# EAGLE design 25LC020A (EAGLE 9.1.3)
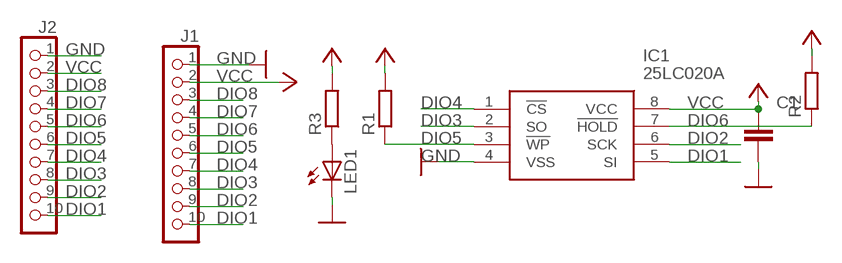
[diagram p0: schematic, sheet 1]

## Parts
C1  CAPACITOR_NPOL-0603  [C603]
IC1  25LC020A  25LC020A-I_SN  [SOIC127P600X175-8N]
J1  CON_HEADER_1X10-RIGHT_ANGLED_PTH  [M1X10_FEMALE_RIGHT_ANGLED_PTH]
J2  CON_HEADER_1X10-PTH  [M1X10]
LED1  LED-0805  [LED-805]
R1  RESISTOR-0603  [R603]
R2  RESISTOR-0603  [R603]
R3  RESISTOR-0603  [R603]

## Nets
DIO1: IC1.5(SI) J1.10 J2.10
DIO2: IC1.6(SCK) J1.9 J2.9
DIO3: IC1.2(SO) J1.8 J2.8
DIO4: IC1.1(!CS) J1.7 J2.7
DIO5: IC1.3(!WP) J1.6 J2.6 R1.1
DIO6: IC1.7(!HOLD) J1.5 J2.5 R2.1
DIO7: J1.4 J2.4
DIO8: J1.3 J2.3
GND: C1.2 IC1.4(VSS) J1.1 J2.1 LED1.C
N$1: LED1.A R3.1
VCC: C1.1 IC1.8(VCC) J1.2 J2.2 R1.2 R2.2 R3.2

## Library data of the parts
C1 = dp_devices.v6:CAPACITOR_NPOL: Non-Polarized capacitor in various packages
IC1 = SamacSys_Parts:25LC020A-I_SN: 2K,256 X 8, 2.5V Serial EE SOIC-8 Source: Datasheet <http://ww1.microchip.com/downloads/en/DeviceDoc/21833G.pdf>; DESCRIPTION: 2K,256 X 8, 2.5V Serial EE SOIC-8; HEIGHT: 1.75mm; MANUFACTURER_NAME: Microchip; MANUFACTURER_PART_NUMBER: 25LC020A-I/SN
J1 J2 = dp_devices.v6:CON_HEADER_1X10
LED1 = dp_devices.v6:LED: Light Emitting Diode
R1-R3 = dp_devices.v6:RESISTOR

## Board
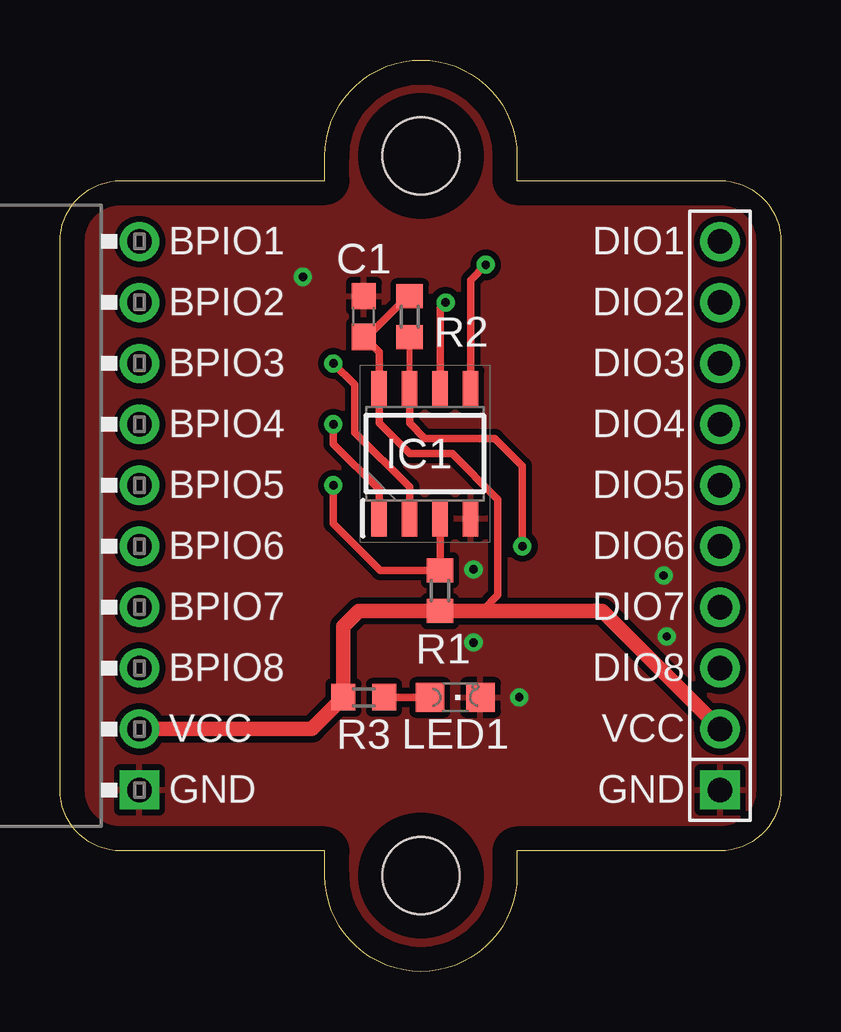
[diagram p1: board, top side]
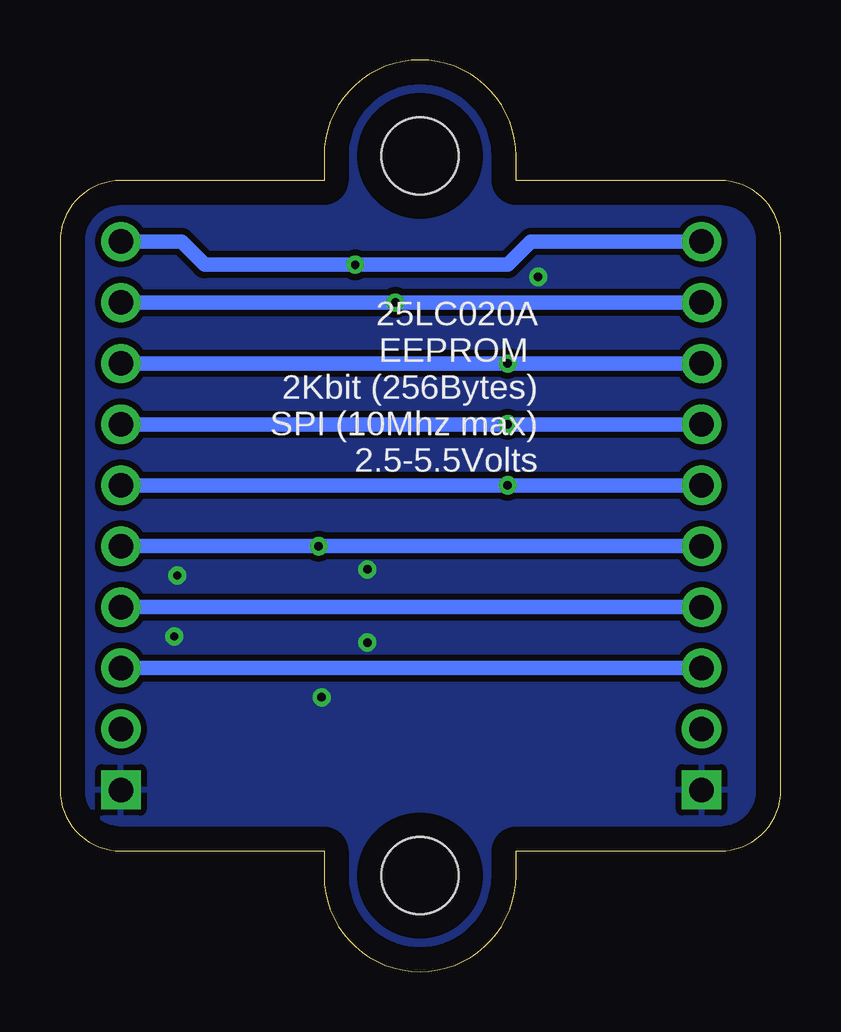
[diagram p2: board, bottom side, seen from below]

Size 30.04 x 38 mm. Coordinates in mm from the lower left corner, seen from the top.
Outline: 19.04,32.97 27.5,32.97 arc-90 30.04,30.43 30.04,7.57 arc-90 27.5,5.03 19.04,5.03 19.04,4 arc-90 15.04,0 arc-90 11.04,4 11.04,5.03 2.54,5.03 arc-90 0,7.57 0,30.43 arc-90 2.54,32.97 11.04,32.97 11.04,34 arc-90 15.04,38 arc-90 19.04,34 19.04,32.97
Copper layers (1*16): Top 0.035mm / dielectric 1.5mm / Bottom 0.035mm
Design rules "default": minimum track width 6mil, minimum drill 0.35mm, track to track 6mil, track to pad 6mil, pad to pad 6mil, via to via 6mil, smd to smd 6mil, copper to edge 40mil, drill to drill 6mil, minimum pad ring 10mil, minimum via ring 8mil, stop-mask expansion 4mil, vias tented up to drill 0mil, thermal gap 10mil
Holes 3.2 mm at 15.04,34 15.04,4
tKeepout: area 11,0 to 19,8; area 11,30 to 19,38
bKeepout: area 11,30 to 19,38; area 11,0 to 19,8
vRestrict: area 11.1,30 to 19.1,38; area 11.1,0 to 19.1,8

### Footprints (pad centres in the part's own frame; a part is rotated, then mirrored left to right if it is on the bottom)
C603 = smd 1.1 x 1: 1 -0.85,0; 2 0.85,0
SOIC127P600X175-8N = smd 1.5 x 0.65: 1 -2.7,1.905; 2 -2.7,0.635; 3 -2.7,-0.635; 4 -2.7,-1.905; 5 2.7,-1.905; 6 2.7,-0.635; 7 2.7,0.635; 8 2.7,1.905
M1X10_FEMALE_RIGHT_ANGLED_PTH = drill 1.02 pad 1.632 square: 1 -11.43,-5.85 | drill 1.02 pad 1.632: 2 -8.89,-5.85; 3 -6.35,-5.85; 4 -3.81,-5.85; 5 -1.27,-5.85; 6 1.27,-5.85; 7 3.81,-5.85; 8 6.35,-5.85; 9 8.89,-5.85; 10 11.43,-5.85
M1X10 = drill 1.02 pad 1.632 square: 1 -11.43,0 | drill 1.02 pad 1.632: 2 -8.89,0; 3 -6.35,0; 4 -3.81,0; 5 -1.27,0; 6 1.27,0; 7 3.81,0; 8 6.35,0; 9 8.89,0; 10 11.43,0
LED-805 = smd 1.2 x 1.2: A 0,-1.05; C 0,1.05
R603 = smd 1 x 1.1: 1 -0.85,0; 2 0.85,0

### Placement (x,y rotation side)
C1  12.66,27.3 90 top
IC1  15.2,21.59 90 top
J1  -2.54,19 90 top
J2  27.5,19 90 top
LED1  16.47,11.43 270 top
R1  15.83,15.88 270 top
R2  14.56,27.3 90 top
R3  12.66,11.43 180 top

### Tracks (layer width: path | path; a pad name or v marks a point on that pad's centre or on a via)
DIO1  (via drill 0.35)
  Top 0.305: v17.74,29.46 17.11,28.83 IC1.5
  Bottom 0.61: J1.10 10.42,30.43 11.39,29.46 v17.74,29.46 24.01,29.46 24.98,30.43 J2.10
DIO2  (via drill 0.35)
  Top 0.305: IC1.6 15.83,27.66 v16.07,27.89
  Bottom 0.61: J1.9 v16.07,27.89 J2.9
DIO3  (via drill 0.35)
  Top 0.305: IC1.2 14.56,20.19 12.28,22.48 12.28,24.46 v11.39,25.35
  Bottom 0.61: J1.8 v11.39,25.35 J2.8
DIO4  (via drill 0.35)
  Top 0.305: v11.39,22.81 11.39,22 13.29,20.09 IC1.1
  Bottom 0.61: J1.7 v11.39,22.81 J2.7
DIO5  (via drill 0.35)
  Top 0.305: IC1.3 15.83,17.78 R1.1 13.33,16.73 11.39,18.67 v11.39,20.27
  Bottom 0.61: J1.6 v11.39,20.27 J2.6
DIO6  (via drill 0.35)
  Top 0.254: IC1.7 R2.1
  Top 0.305: IC1.7 14.56,22.86 15.2,22.23 18.12,22.23 19.26,21.08 v19.26,17.73
  Bottom 0.61: J1.5 v19.26,17.73 J2.5
DIO7
  Bottom 0.61: J2.4 J1.4
DIO8
  Bottom 0.61: J2.3 J1.3
GND  (via drill 0.35)
  other vias: 17.23,16.76 17.23,13.72 25.28,13.97 25.15,16.51 10.12,28.96 19.14,11.43
  pour Top (isolate 0.254, rank 6): 0,38 0,0 30.04,0 30.04,38
  pour Bottom (isolate 0.254, rank 6): 0,38 0,0 30.04,0 30.04,38
N$1
  Top 0.305: R3.1 LED1.A
VCC
  Top 0.152: 14.44,28.16 R2.2
  Top 0.305: 17.59,15.03 18.25,15.69 18.25,19.68 16.34,21.59 14.56,21.59 13.29,22.86 IC1.8 13.29,25.82 C1.1 12.79,26.45 14.44,28.11 14.44,28.16
  Top 0.61: J1.2 10.49,10.11 R3.2 11.81,14.39 12.44,15.03 R1.2 17.59,15.03 22.59,15.03 J2.2

### Text on the board
tPlace: No breakable design yet / M3 Holes spacing is 30mm / Label bus piratre side and breakout side MOSI/DIO1 / Standard board size for larger stuff? / Standard LED position? | BPIO1 | DIO1 | BPIO2 | DIO2 | BPIO3 | DIO3 | BPIO4 | DIO4 | BPIO5 | DIO5 | BPIO6 | DIO6 | BPIO7 | DIO7 | BPIO8 | DIO8 | VCC | VCC | GND | GND
bNames: 25LC020A / EEPROM / 2Kbit (256Bytes) / SPI (10Mhz max) / 2.5-5.5Volts